# EAGLE design Car Sensor (EAGLE 8.3.1)
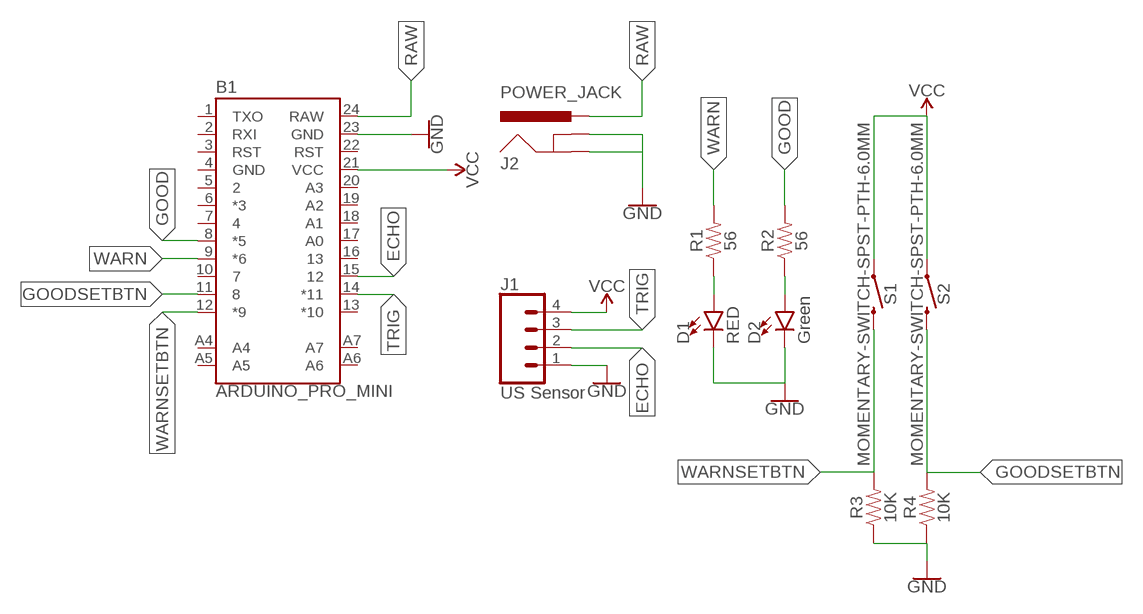
[diagram p0: schematic, sheet 1]

## Parts
B1  ARDUINO_PRO_MINI  [ARDUINO_PRO_MINI]
D1  RED  LED5MM  [LED_5MM]
D2  Green  LED5MM  [LED_5MM]
J1  US Sensor  CONN_04SMD_RA_FEMALE  [1X04_SMD_RA_FEMALE]
J2  POWER_JACK  [POWER_JACK_PTH]
R1  56  RESISTOR0805  [0805]
R2  56  RESISTOR0805  [0805]
R3  10K  RESISTOR0805  [0805]
R4  10K  RESISTOR0805  [0805]
S1  MOMENTARY-SWITCH-SPST-PTH-6.0MM  [TACTILE_SWITCH_PTH_6.0MM]
S2  MOMENTARY-SWITCH-SPST-PTH-6.0MM  [TACTILE_SWITCH_PTH_6.0MM]

## Nets
ECHO: B1.15 J1.2
GND: B1.23(GND) D1.K(C) D2.K(C) J1.1 J2.GND J2.GNDBREAK R3.1 R4.1
GOOD: B1.8(*5) R2.2
GOODSETBTN: B1.11 R4.2 S2.3
N$1: D1.A R1.1
N$2: D2.A R2.1
RAW: B1.24(RAW) J2.PWR
TRIG: B1.14(*11) J1.3
VCC: B1.21(VCC) J1.4 S1.1 S2.1
WARN: B1.9(*6) R1.2
WARNSETBTN: B1.12(*9) R3.2 S1.3
Unconnected: B1.1(TXO) B1.2(RXI) B1.3(RST) B1.5 B1.6(*3) B1.7 B1.10 B1.13(*10) B1.16 B1.17(A0) B1.18(A1) B1.19(A2) B1.20(A3) B1.22(RST) B1.A4 B1.A5 B1.A6 B1.A7

## Power pins joined to a net without a drawn wire
GND: B1.4(GND)

## Library data of the parts
B1 = SparkFun-Boards:ARDUINO_PRO_MINI: SparkFun Pro Mini Pro Mini compatible footprint. Dimensions: 0.7 x 1.3" PCB Thickness: 0.8mm SparkFun Products: 3.3V/8MHz <https://www.sparkfun.com/products/11114> 5V/16MHz <https://www.sparkfun.com/products/11113>
D1 D2 = SparkFun-LED:LED: LED (Generic) Standard schematic elements and footprints for 5mm, 3mm, 1206, and 0603 sized LEDs. Generic LEDs with no color specified.
J1 = SparkFun-Connectors:CONN_04: Multi connection point. Often used as Generic Header-pin footprint for 0.1 inch spaced/style header connections On any of the 0.1 inch spaced packages, you can populate with these: Break Away Headers - Straight <https://www.sparkfun.com/products/116> (PRT-00116) Break Away Male Headers - Right Angle <https://www.sparkfun.com/products/553> (PRT-00553) Female Headers <https://www.sparkfun.com/products/115> (PRT-00115) Break Away Headers - Machine Pin <https://www.sparkfun.com/products/117> (PRT-00117) Break Away Female Headers - Swiss Machine Pin <https://www.sparkfun.com/products/743> (PRT-00743) For SCREWTERMINALS and SPRING TERMINALS visit here: Screw Terimnals on SparkFun.com <https://www.sparkfun.com/search/results?term=Screw+Terminals> (5mm/3.5mm/2.54mm spacing) This device is also useful as a general connection point to wire up your design to another part of your project. Our various solder wires solder well into these plated through hole pads. Hook-Up Wire - Assortment (Stranded, 22 AWG) <https://www.sparkfun.com/products/11375> (PRT-11375) Hook-Up Wire - Assortment (Solid Core, 22 AWG) <https://www.sparkfun.com/products/11367> (PRT-11367) View the entire wire category on our website here <https://www.sparkfun.com/categories/141> Special notes: Molex polarized connector foot print use with SKU : PRT-08231 with associated crimp pins and housings. 1MM SMD Version SKU: PRT-10208; PROD_ID: CONN-12382
J2 = SparkFun-Connectors:POWER_JACK: Power Jack Connector This is the standard 5.5mm barrel jack for power. The PTH is the most common, proven, reliable, footprint. The Slot footprint only works if the mill layer is transmitted to the PCB fab house so be warned. Here are the connectors we sell at SparkFun: DC Barrel Power Jack/Connector <https://www.sparkfun.com/products/119> (PRT-00119) DC Barrel Power Jack/Connector (SMD) <https://www.sparkfun.com/products/12748> (PRT-12748) DC Barrel Jack Adapter - Breadboard Compatible <https://www.sparkfun.com/products/10811> (PRT-10811) It is used on this SparkFun product (and many, many others): SparkFun RedBoard - Programmed with Arduino <https://www.sparkfun.com/products/12757> (DEV-12757) Also, if you need a mating power supply or connector, please check these out: Wall Adapter Power Supply - 9VDC 650mA <https://www.sparkfun.com/products/298> (TOL-00298) DC Barrel Jack Adapter - Male <https://www.sparkfun.com/products/10287> (PRT-10287); PROD_ID: CONN-08197
R1-R4 = SparkFun-Resistors:RESISTOR: Generic Resistor Package
S1 S2 = SparkFun-Switches:MOMENTARY-SWITCH-SPST: Momentary Switch (Pushbutton) - SPST Normally-open (NO) SPST momentary switches (buttons, pushbuttons). Variants PTH-12MM - 12mm square, through-hole Momentary Pushbutton Switch - 12mm Square <https://www.sparkfun.com/products/9190> (COM-09190) PTH-6.0MM, PTH-6.0MM-KIT - 6.0mm square, through-hole Mini Pushbutton Switch <https://www.sparkfun.com/products/97> (COM-00097) KIT package intended for soldering kit's - only one side of pads' copper is exposed. PTH-RIGHT-ANGLE-KIT - Right-angle, through-hole Right Angle Tactile Button <https://www.sparkfun.com/products/10791> - Used on SparkFun BigTime Watch Kit <https://www.sparkfun.com/products/11734> SMD-12MM - 12mm square, surface-mount Tactile Button - SMD (12mm) <https://www.sparkfun.com/products/12993> (COM-12993) Used on SparkFun PicoBoard <https://www.sparkfun.com/products/11888> SMD-4.5MM - 4.5mm Square Trackball Switch Used on SparkFun Blackberry Trackballer Breakout <https://www.sparkfun.com/products/13169> SMD-4.6MMX2.8MM - 4.60mm x 2.80mm, surface mount Used on SparkFun SAMD21 Mini Breakout <https://www.sparkfun.com/products/13664> SMD-5.2MM, SMD-5.2-REDUNDANT - 5.2mm square, surface-mount Mini Pushbutton Switch - SMD <https://www.sparkfun.com/products/8720> (COM-08720) Used on Arduino Pro Mini <https://www.sparkfun.com/products/11114> REDUNDANT package connects both switch circuits together SMD-6.0X3.5MM - 6.0 x 3.5mm, surface mount Momentary Reset Switch SMD <https://www.sparkfun.com/products/8229> (COM-08229) SMD-6.2MM-TALL - 6.2mm square, surface mount Tactile Button - SMD (6mm) <https://www.sparkfun.com/products/12992> Used on SparkFun Digital Sandbox <https://www.sparkfun.com/products/12651> SMD-RIGHT-ANGLE - Right-angle, surface mount Used on SparkFun Block for Intel® Edison - Arduino <https://www.sparkfun.com/products/13036>; PROD_ID: SWCH-08441; SF_SKU: COM-00097

## Board
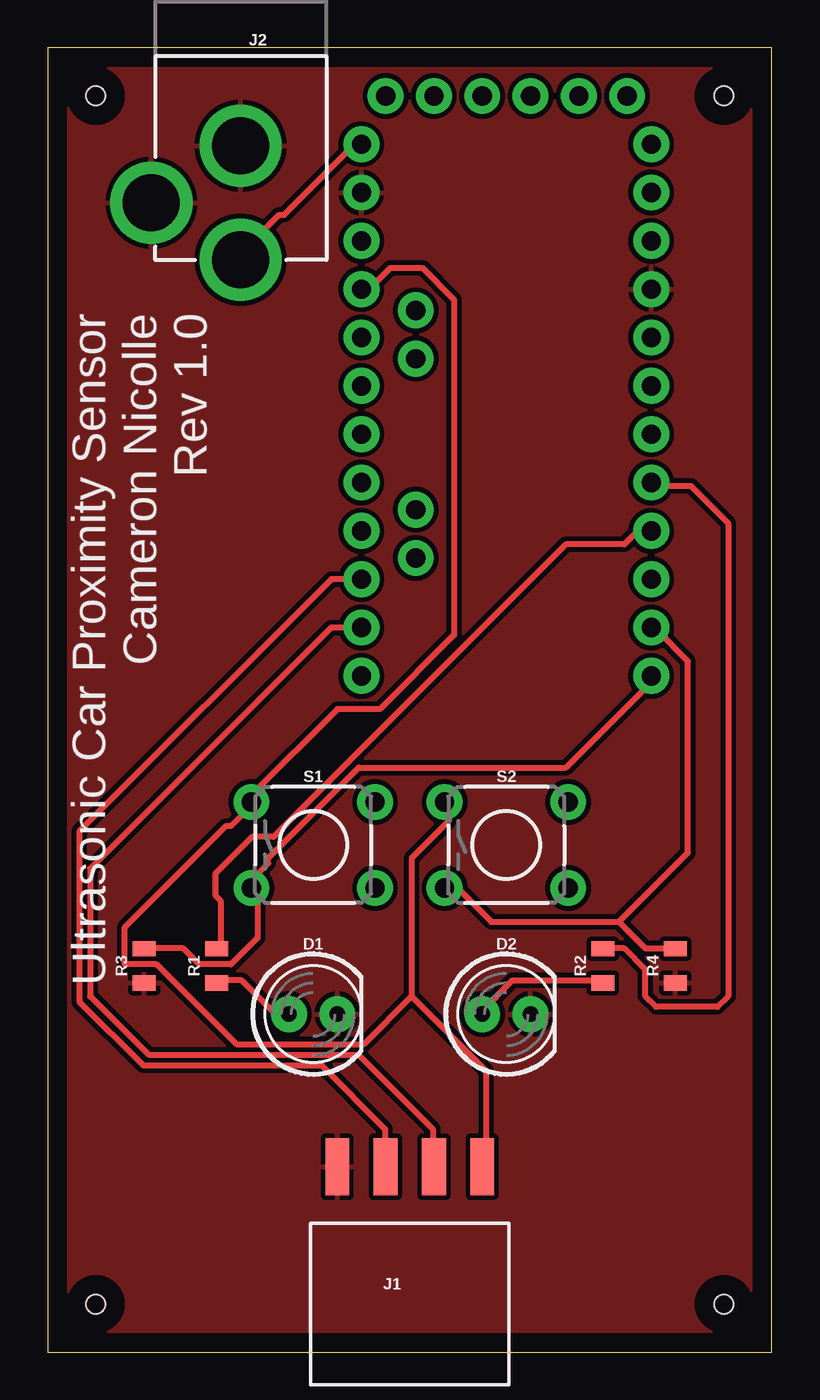
[diagram p1: board, top side]
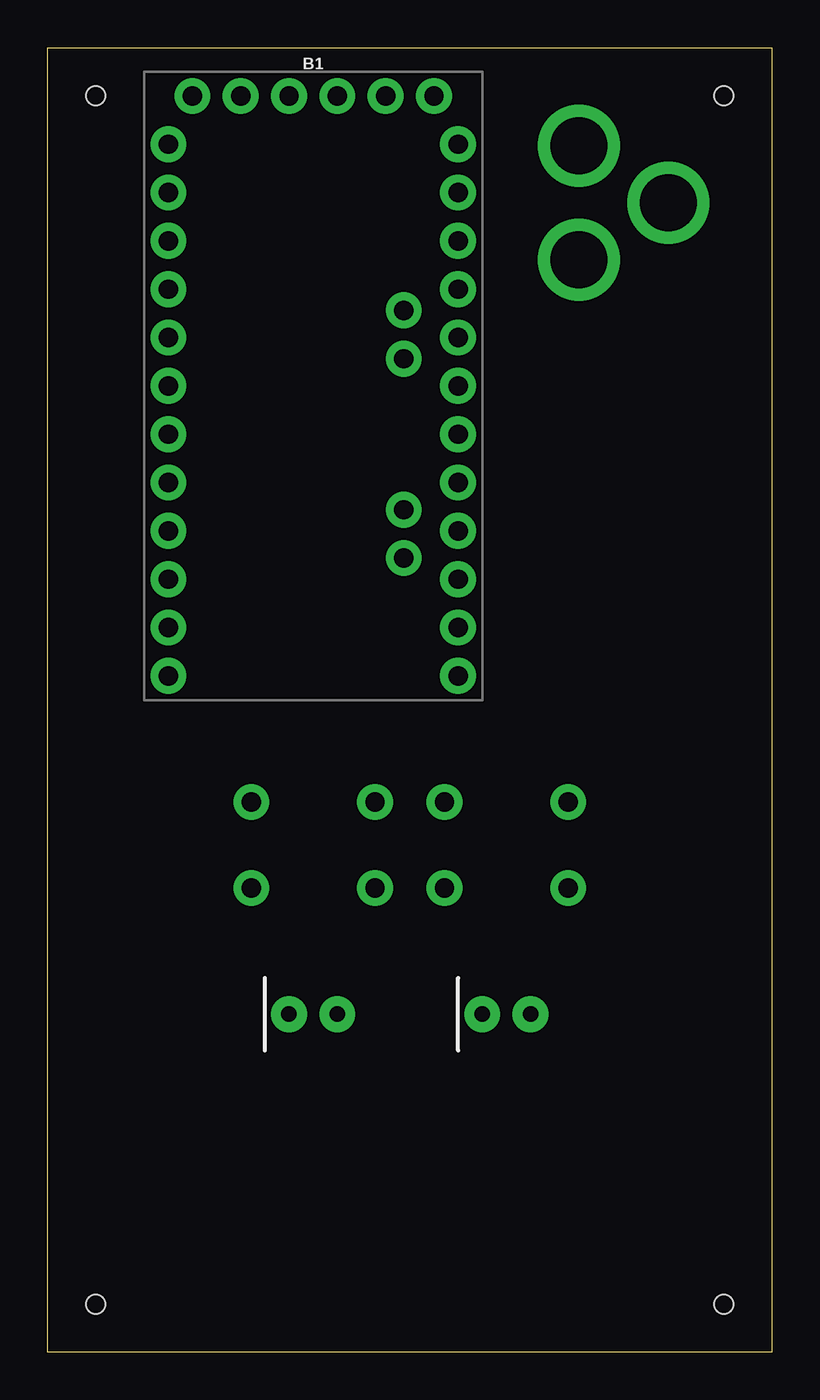
[diagram p2: board, bottom side, seen from below]

Size 38.1 x 68.58 mm. Coordinates in mm from the lower left corner, seen from the top.
Outline: 0,0 38.1,0 38.1,68.58 0,68.58 0,0
Copper layers (1*16): Top 0.035mm / dielectric 1.5mm / Bottom 0.035mm
Design rules "default *": minimum track width 12mil, minimum drill 0.35mm, track to track 10mil, track to pad 10mil, pad to pad 10mil, via to via 10mil, smd to smd 10mil, copper to edge 40mil, drill to drill 6mil, minimum pad ring 10mil, minimum via ring 8mil, stop-mask expansion 4mil, vias tented up to drill 0mil, thermal gap 10mil
Holes 1 mm at 2.54,2.54 35.56,2.54 2.54,66.04 35.56,66.04

### Footprints (pad centres in the part's own frame; a part is rotated, then mirrored left to right if it is on the bottom)
ARDUINO_PRO_MINI = drill 1.016 pad 1.88: 1 -7.62,12.7; 2 -7.62,10.16; 3 -7.62,7.62; 4 -7.62,5.08; 5 -7.62,2.54; 6 -7.62,0; 7 -7.62,-2.54; 8 -7.62,-5.08; 9 -7.62,-7.62; 10 -7.62,-10.16; 11 -7.62,-12.7; 12 -7.62,-15.24; 13 7.62,-15.24; 14 7.62,-12.7; 15 7.62,-10.16; 16 7.62,-7.62; 17 7.62,-5.08; 18 7.62,-2.54; 19 7.62,0; 20 7.62,2.54; 21 7.62,5.08; 22 7.62,7.62; 23 7.62,10.16; 24 7.62,12.7; A4 4.763,1.429; A5 4.763,3.969; A6 4.763,-9.049; A7 4.763,-6.509; BLK -6.35,15.24; GND -3.81,15.24; GRN 6.35,15.24; RXI 1.27,15.24; TXO 3.81,15.24; VCC -1.27,15.24
LED_5MM = drill 0.813 pad 1.88: A -1.27,0; K 1.27,0
1X04_SMD_RA_FEMALE = smd 1.25 x 3: 1 -3.81,7.225; 2 -1.27,7.225; 3 1.27,7.225; 4 3.81,7.225
POWER_JACK_PTH = drill 2.997 pad 4.318: GND 0,7.7; GNDBREAK 4.7,10.7; PWR 0,13.7
0805 = smd 0.8 x 1.2: 1 -0.9,0; 2 0.9,0
TACTILE_SWITCH_PTH_6.0MM = drill 1.016 pad 1.88: 1 -3.251,2.261; 2 3.251,2.261; 3 -3.251,-2.261; 4 3.251,-2.261

### Placement (x,y rotation side)
B1  24.13,50.8 0 bottom
D1  13.97,17.78 0 top
D2  24.13,17.78 0 top
J1  19.05,2.54 0 top
J2  10.16,71.12 180 top
R1  8.89,20.32 90 top
R2  29.21,20.32 90 top
R3  5.08,20.32 90 top
R4  33.02,20.32 90 top
S1  13.97,26.67 0 top
S2  24.13,26.67 0 top

### Tracks (layer width: path | path; a pad name or v marks a point on that pad's centre or on a via)
ECHO
  Top 0.305: J1.2 17.75,9.78 17.75,11.73 14.4,15.09 5.03,15.09 1.68,18.44 1.68,27.38 14.93,40.64 B1.15
GND
  pour Top: 0.13,68.45 37.97,68.45 37.97,0.13 0.13,0.13
GOOD
  Top 0.305: R2.2 29.21,21.23 30.33,21.23 31.45,20.12 31.45,18.72 32,18.16 35.23,18.16 35.79,18.72 35.79,43.59 33.83,45.54 32,45.54 B1.8
GOODSETBTN
  Top 0.305: 30.05,22.63 31.45,21.23 32.84,21.23 R4.2 | 30.05,22.63 23.34,22.63 21.67,24.31 21.11,24.31 S2.3 | 30.05,22.63 33.68,26.26 33.68,36.32 32,38 B1.11
N$1
  Top 0.305: R1.1 9.09,19.56 10.21,19.56 11.89,17.88 12.45,17.88 D1.A
N$2
  Top 0.305: R2.1 29.21,19.56 24.46,19.56 22.78,17.88 D2.A
RAW
  Top 0.305: B1.24 16.36,63.42 16.08,63.42 12.45,59.79 12.17,59.79 9.93,57.56 J2.PWR
TRIG
  Top 0.305: J1.3 20.27,9.78 20.27,11.73 16.36,15.65 5.31,15.65 2.23,18.72 2.23,25.43 14.91,38.1 B1.14
VCC
  Top 0.305: 19.15,18.72 23.06,14.81 23.06,9.78 J1.4 | 19.15,18.72 19.15,25.98 21.11,27.94 21.11,28.78 S2.1 | B1.21 16.92,55.88 18.03,57 19.71,57 21.39,55.32 21.39,37.72 17.47,33.81 15.24,33.81 10.77,29.34 10.77,29.06 S1.1 10.77,28.78 9.65,27.66 9.37,27.66 4.06,22.35 4.06,20.4 5.74,20.4 9.93,16.2 16.64,16.2 19.15,18.72
WARN
  Top 0.305: R1.2 9.09,21.23 9.09,23.75 8.81,24.03 8.81,25.15 10.77,27.1 11.89,27.1 27.25,42.47 30.33,42.47 30.89,43.03 31.72,43.03 B1.9
WARNSETBTN
  Top 0.305: R3.2 5.18,21.23 7.14,21.23 7.98,20.4 9.65,20.4 11.05,21.79 11.05,23.19 11.07,24.11 10.49,24.31 S1.3 10.49,24.59 11.61,25.7 11.61,25.98 16.36,30.73 27.25,30.73 31.72,35.2 31.72,35.48 B1.12

### Text on the board
tPlace: Ultrasonic Car Proximity Sensor / Cameron Nicolle / Rev 1.0